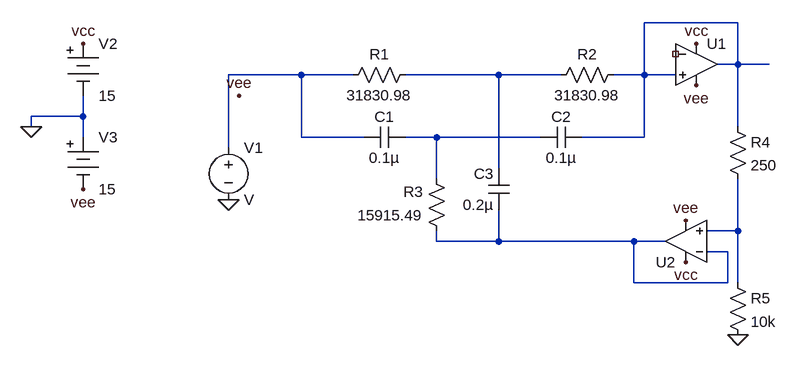
[diagram p0: schematic Twin-T Notch Filter for Microphone.asc]
Twin-T Notch Filter for Microphone.asc, the LTspice schematic file:
Version 4
SHEET 1 880 680
WIRE 768 -112 624 -112
WIRE 768 -48 768 -112
WIRE 768 -48 736 -48
WIRE 816 -48 768 -48
WIRE 96 -32 -16 -32
WIRE 176 -32 96 -32
WIRE 400 -32 256 -32
WIRE 496 -32 400 -32
WIRE 624 -32 624 -112
WIRE 624 -32 576 -32
WIRE 672 -32 624 -32
WIRE -240 32 -240 0
WIRE -240 32 -320 32
WIRE -320 48 -320 32
WIRE 768 48 768 -48
WIRE -240 64 -240 32
WIRE 96 64 96 -32
WIRE 192 64 96 64
WIRE 304 64 256 64
WIRE 464 64 304 64
WIRE 624 64 624 -32
WIRE 624 64 528 64
WIRE -16 80 -16 -32
WIRE 400 112 400 -32
WIRE 304 128 304 64
WIRE 768 208 768 128
WIRE 768 208 720 208
WIRE 304 224 304 208
WIRE 400 224 400 176
WIRE 400 224 304 224
WIRE 608 224 400 224
WIRE 656 224 608 224
WIRE 752 240 720 240
WIRE 608 288 608 224
WIRE 752 288 752 240
WIRE 752 288 608 288
WIRE 768 288 768 208
FLAG -16 160 0
FLAG 768 368 0
FLAG -320 48 0
FLAG -240 -80 vcc
FLAG 704 -80 vcc
FLAG 688 256 vcc
FLAG -240 144 vee
FLAG 704 -16 vee
FLAG 688 192 vee
FLAG 0 0 vee
SYMBOL voltage -16 64 R0
SYMATTR InstName V1
SYMBOL res 272 -48 R90
WINDOW 0 0 56 VBottom 2
WINDOW 3 32 56 VTop 2
SYMATTR InstName R1
SYMATTR Value 31830.98
SYMBOL cap 256 48 R90
WINDOW 0 0 32 VBottom 2
WINDOW 3 32 32 VTop 2
SYMATTR InstName C1
SYMATTR Value 0.1µ
SYMBOL res 592 -48 R90
WINDOW 0 0 56 VBottom 2
WINDOW 3 32 56 VTop 2
SYMATTR InstName R2
SYMATTR Value 31830.98
SYMBOL cap 528 48 R90
WINDOW 0 0 32 VBottom 2
WINDOW 3 32 32 VTop 2
SYMATTR InstName C2
SYMATTR Value 0.1µ
SYMBOL cap 416 176 R180
WINDOW 0 24 56 Left 2
WINDOW 3 24 8 Left 2
SYMATTR InstName C3
SYMATTR Value 0.2µ
SYMBOL res 320 224 R180
WINDOW 0 36 76 Left 2
WINDOW 3 36 40 Left 2
SYMATTR InstName R3
SYMATTR Value 15915.49
SYMBOL OpAmps\\UniversalOpAmp2 704 -48 R0
SYMATTR InstName U1
SYMBOL OpAmps\\UniversalOpAmp2 688 224 R180
SYMATTR InstName U2
SYMBOL res 752 32 R0
WINDOW 3 36 75 Left 2
SYMATTR InstName R4
SYMATTR Value 250
SYMBOL res 752 272 R0
SYMATTR InstName R5
SYMATTR Value 10k
SYMBOL Misc\\battery -240 -96 R0
SYMATTR InstName V2
SYMATTR Value 15
SYMBOL Misc\\battery -240 48 R0
SYMATTR InstName V3
SYMATTR Value 15

The netlist it stands for:
* Twin-T Notch Filter for Microphone.asc
V1 N002 0 V
R1 N003 N002 31830.98
C1 N004 N002 0.1µ
R2 N001 N003 31830.98
C2 N001 N004 0.1µ
C3 N006 N003 0.2µ
R3 N006 N004 15915.49
XU1 N001 NC_01 vcc vee N001 level2 Avol=1Meg GBW=10Meg Slew=10Meg Ilimit=25m Rail=0 Vos=0 En=0 Enk=0 In=0 Ink=0 Rin=500Meg  ; pins In+ In- V+ V- OUT
XU2 N005 N006 vcc vee N006 level2 Avol=1Meg GBW=10Meg Slew=10Meg Ilimit=25m Rail=0 Vos=0 En=0 Enk=0 In=0 Ink=0 Rin=500Meg  ; pins In+ In- V+ V- OUT
R4 N001 N005 250
R5 N005 0 10k
V2 vcc 0 15
V3 0 vee 15
.lib UniversalOpAmp2.lib
.backanno
.end